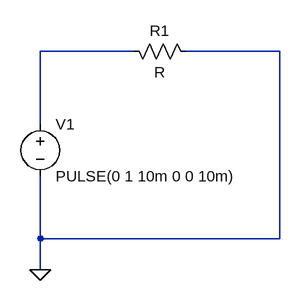
[diagram p0: schematic Draft1.asc]
Draft1.asc, the LTspice schematic file:
Version 4
SHEET 1 880 680
WIRE 240 -16 96 -16
WIRE 464 -16 320 -16
WIRE 96 96 96 -16
WIRE 96 272 96 176
WIRE 464 272 464 -16
WIRE 464 272 96 272
WIRE 96 320 96 272
FLAG 96 320 0
SYMBOL voltage 96 80 R0
WINDOW 123 0 0 Left 2
WINDOW 39 0 0 Left 2
SYMATTR InstName V1
SYMATTR Value PULSE(0 1 10m 0 0 10m)
SYMBOL res 336 0 M270
WINDOW 0 32 56 VTop 2
WINDOW 3 0 56 VBottom 2
SYMATTR InstName R1

The netlist it stands for:
* Draft1.asc
V1 N001 0 PULSE(0 1 10m 0 0 10m)
R1 0 N001 R
.backanno
.end